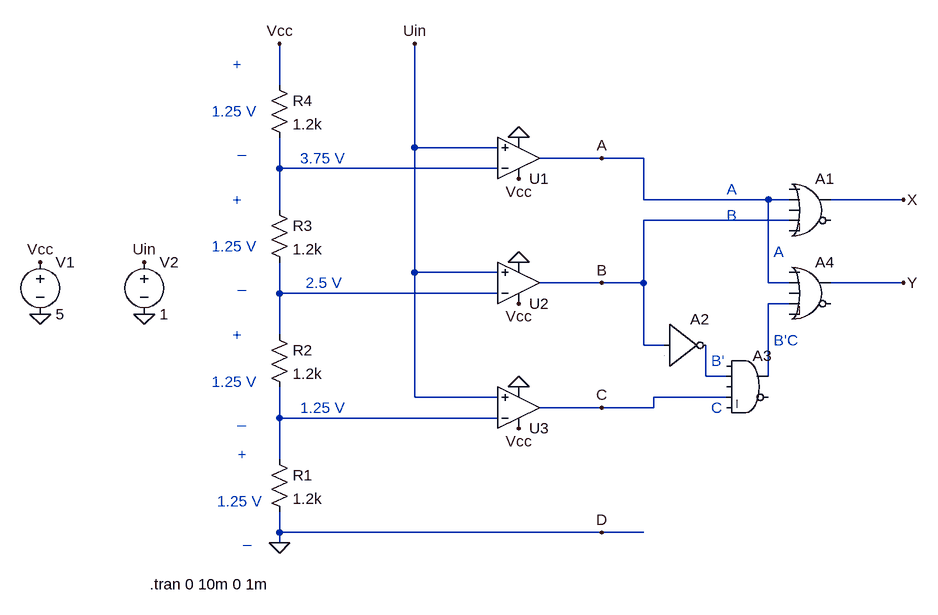
[diagram p0: schematic adc.asc]
adc.asc, the LTspice schematic file:
Version 4
SHEET 1 1488 680
WIRE 496 -240 496 -304
WIRE 704 -144 704 -304
WIRE 832 -144 704 -144
WIRE 992 -128 896 -128
WIRE 1056 -128 992 -128
WIRE 496 -112 496 -160
WIRE 832 -112 496 -112
WIRE 1056 -64 1056 -128
WIRE 1248 -64 1056 -64
WIRE 1280 -64 1248 -64
WIRE 1456 -64 1344 -64
WIRE 496 -48 496 -112
WIRE 1280 -32 1056 -32
WIRE 704 48 704 -144
WIRE 832 48 704 48
WIRE 992 64 896 64
WIRE 1056 64 1056 -32
WIRE 1056 64 992 64
WIRE 1248 64 1248 -64
WIRE 1280 64 1248 64
WIRE 1456 64 1344 64
WIRE 496 80 496 32
WIRE 832 80 496 80
WIRE 1280 96 1248 96
WIRE 496 144 496 80
WIRE 1056 160 1056 64
WIRE 1088 160 1056 160
WIRE 1152 208 1152 160
WIRE 1184 208 1152 208
WIRE 1248 208 1248 96
WIRE 704 240 704 48
WIRE 832 240 704 240
WIRE 1184 240 1072 240
WIRE 992 256 896 256
WIRE 1072 256 1072 240
WIRE 1072 256 992 256
WIRE 496 272 496 224
WIRE 832 272 496 272
WIRE 496 336 496 272
WIRE 496 448 496 416
WIRE 992 448 496 448
WIRE 1056 448 992 448
WIRE 496 464 496 448
FLAG 128 112 0
FLAG 288 112 0
FLAG 128 32 Vcc
FLAG 288 32 Uin
FLAG 496 464 0
FLAG 496 -304 Vcc
FLAG 864 -96 Vcc
FLAG 864 96 Vcc
FLAG 864 288 Vcc
FLAG 864 -160 0
FLAG 864 32 0
FLAG 864 224 0
FLAG 704 -304 Uin
FLAG 992 -128 A
FLAG 992 64 B
FLAG 992 256 C
FLAG 992 448 D
FLAG 1456 -64 X
FLAG 1456 64 Y
SYMBOL voltage 128 16 R0
WINDOW 123 0 0 Left 0
WINDOW 39 0 0 Left 0
SYMATTR InstName V1
SYMATTR Value 5
SYMBOL voltage 288 16 R0
WINDOW 123 0 0 Left 0
WINDOW 39 0 0 Left 0
SYMATTR InstName V2
SYMATTR Value 1
SYMBOL res 480 320 R0
SYMATTR InstName R1
SYMATTR Value 1.2k
SYMBOL res 480 128 R0
SYMATTR InstName R2
SYMATTR Value 1.2k
SYMBOL res 480 -64 R0
SYMATTR InstName R3
SYMATTR Value 1.2k
SYMBOL res 480 -256 R0
SYMATTR InstName R4
SYMATTR Value 1.2k
SYMBOL OpAmps\\UniversalOpAmp2 864 -128 M180
SYMATTR InstName U1
SYMBOL OpAmps\\UniversalOpAmp2 864 64 M180
SYMATTR InstName U2
SYMBOL OpAmps\\UniversalOpAmp2 864 256 M180
SYMATTR InstName U3
SYMBOL Digital\\or 1312 -112 R0
SYMATTR InstName A1
SYMBOL Digital\\inv 1088 96 R0
SYMATTR InstName A2
SYMBOL Digital\\and 1216 160 R0
SYMATTR InstName A3
SYMBOL Digital\\or 1312 16 R0
SYMATTR InstName A4
TEXT 424 -272 Left 2 ;+
TEXT 432 -144 Left 2 ;_
TEXT 392 -200 Left 2 ;1.25 V
TEXT 424 -64 Left 2 ;+
TEXT 432 64 Left 2 ;_
TEXT 392 8 Left 2 ;1.25 V
TEXT 424 144 Left 2 ;+
TEXT 432 272 Left 2 ;_
TEXT 392 216 Left 2 ;1.25 V
TEXT 432 328 Left 2 ;+
TEXT 440 456 Left 2 ;_
TEXT 400 400 Left 2 ;1.25 V
TEXT 528 -128 Left 2 ;3.75 V
TEXT 536 64 Left 2 ;2.5 V
TEXT 528 256 Left 2 ;1.25 V
TEXT 296 528 Left 2 !.tran 0 10m 0 1m
TEXT 1256 152 Left 2 ;B'C
TEXT 1256 16 Left 2 ;A
TEXT 1160 184 Left 2 ;B'
TEXT 1160 256 Left 2 ;C
TEXT 1184 -80 Left 2 ;A
TEXT 1184 -40 Left 2 ;B

The netlist it stands for:
* adc.asc
V1 Vcc 0 5
V2 Uin 0 1
R1 N005 0 1.2k
R2 N002 N005 1.2k
R3 N001 N002 1.2k
R4 Vcc N001 1.2k
XU1 Uin N001 Vcc 0 A level2 Avol=1Meg GBW=10Meg Slew=10Meg Ilimit=25m Rail=0 Vos=0 En=0 Enk=0 In=0 Ink=0 Rin=500Meg  ; pins In+ In- V+ V- OUT
XU2 Uin N002 Vcc 0 B level2 Avol=1Meg GBW=10Meg Slew=10Meg Ilimit=25m Rail=0 Vos=0 En=0 Enk=0 In=0 Ink=0 Rin=500Meg  ; pins In+ In- V+ V- OUT
XU3 Uin N005 Vcc 0 C level2 Avol=1Meg GBW=10Meg Slew=10Meg Ilimit=25m Rail=0 Vos=0 En=0 Enk=0 In=0 Ink=0 Rin=500Meg  ; pins In+ In- V+ V- OUT
A1 0 A 0 B 0 0 X 0 OR
A2 B 0 0 0 0 N004 0 0 BUF
A3 0 N004 0 C 0 0 N003 0 AND
A4 0 A 0 N003 0 0 Y 0 OR
* +
* _
* 1.25 V
* +
* _
* 1.25 V
* +
* _
* 1.25 V
* +
* _
* 1.25 V
* 3.75 V
* 2.5 V
* 1.25 V
.tran 0 10m 0 1m
* B'C
* A
* B'
* C
* A
* B
.lib UniversalOpAmp2.lib
.backanno
.end